# EAGLE schematic COM_R_BOARD (EAGLE 9.6.2)
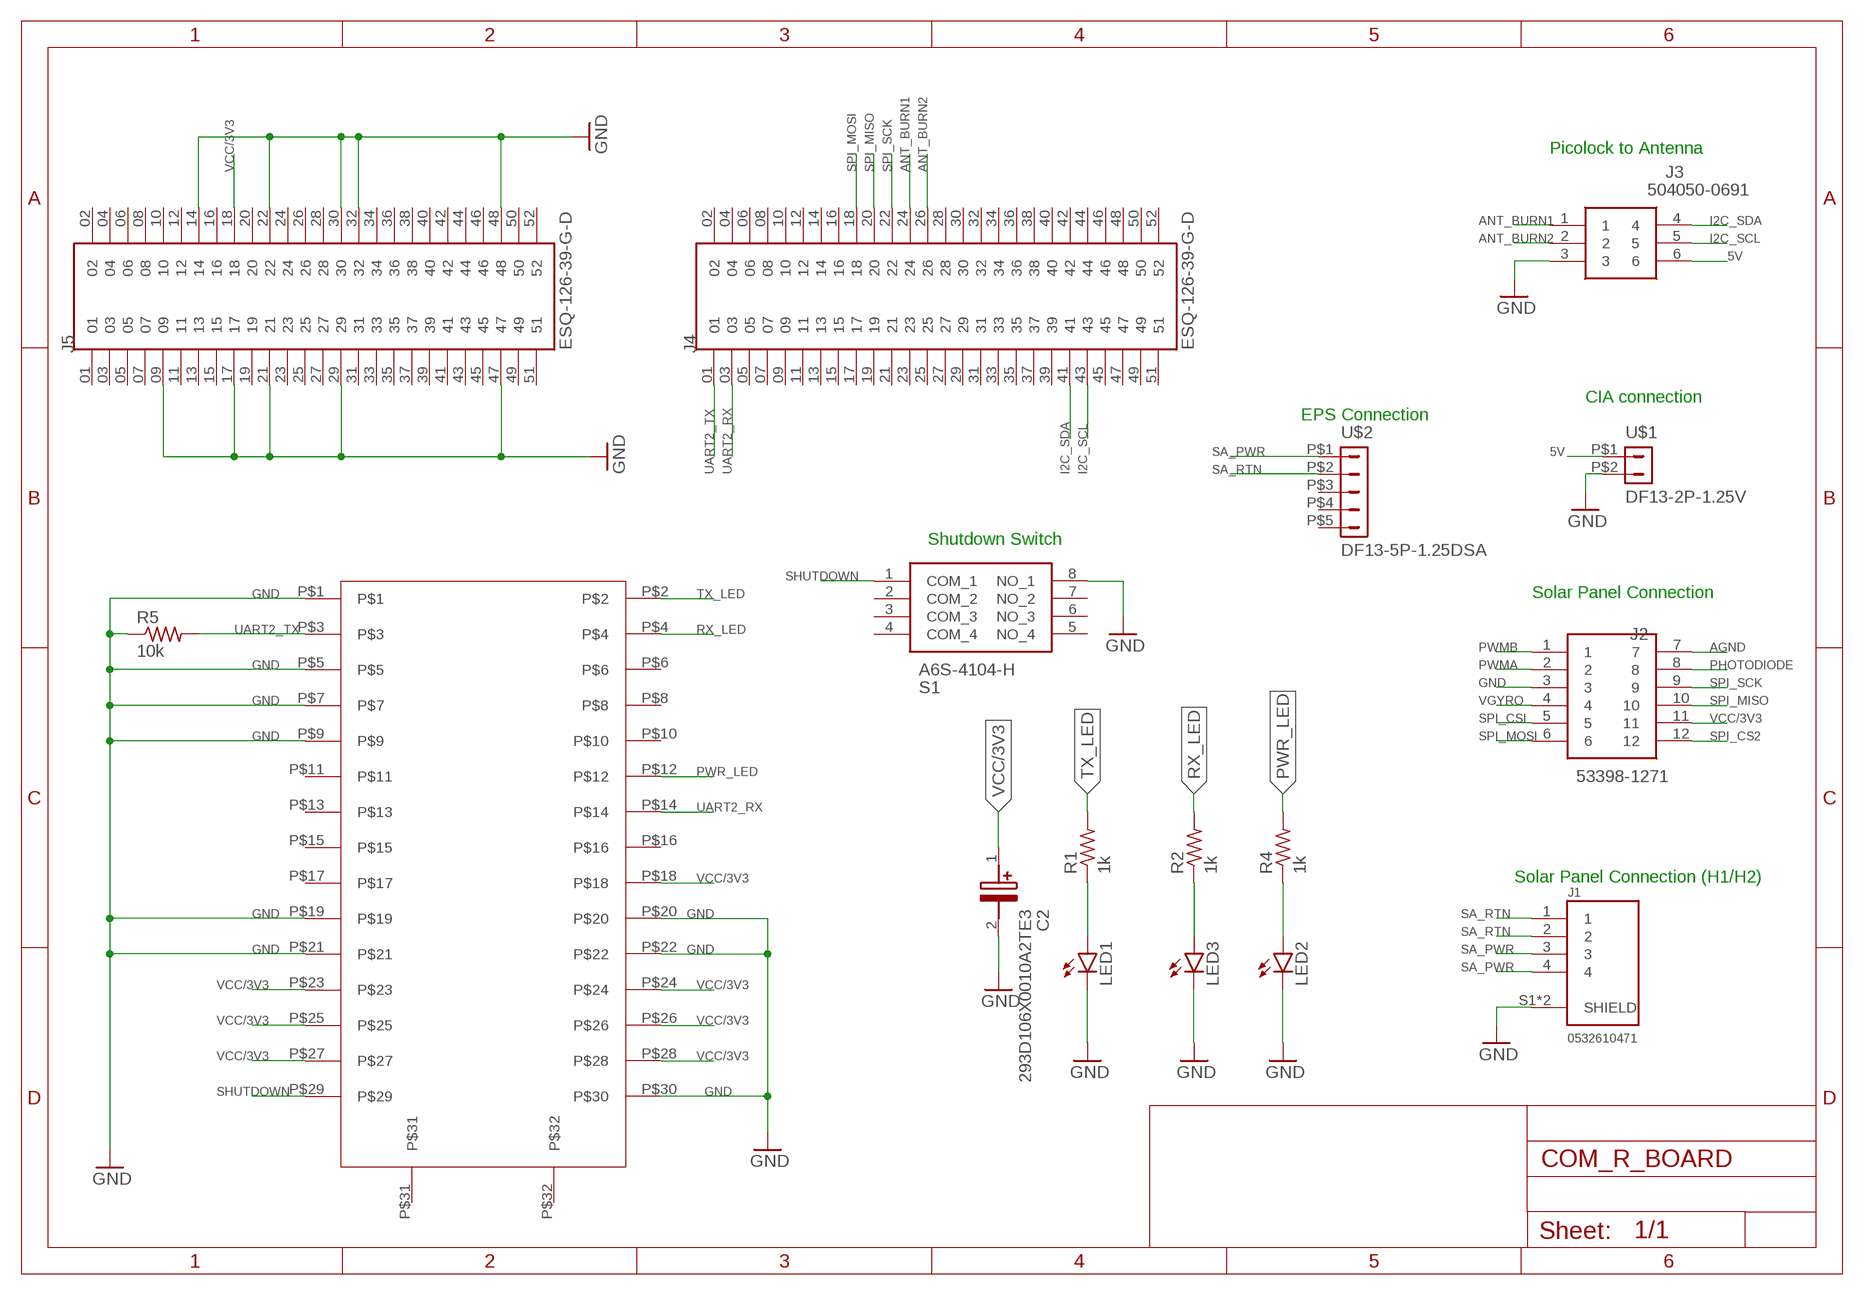
[diagram p0: schematic, sheet 1]

## Parts
C2  293D106X0010A2TE3  [CAPPM3216X180N]
J1  0532610471  [MOLEX_0532610471]
J2  53398-1271  [53398-1271]
J3  504050-0691  [504050-0691_2]
J4  ESQ-126-39-G-D  [SAMTEC_ESQ-126-39-G-D]
J5  ESQ-126-39-G-D  [SAMTEC_ESQ-126-39-G-D]
LED1  LEDCHIP-LED0805  [CHIP-LED0805]
LED2  LEDCHIP-LED0805  [CHIP-LED0805]
LED3  LEDCHIP-LED0805  [CHIP-LED0805]
R1  1k  R-US_M0805  [M0805]
R2  1k  R-US_M0805  [M0805]
R4  1k  R-US_M0805  [M0805]
R5  10k  R-US_WSC01/2  [WSC01/2]
S1  A6S-4104-H  [A6S4104H]
U$1  DF13-2P-1.25V  [DF13C-2P-1.25V]
U$2  DF13-5P-1.25DSA  [DF13-5P-1.25DSA]
U$3  KYOCERA_5046_30PIN  [KYOCERA_5046_30PIN]

## Nets
5V: J3.6 U$1.P$1
AGND: J2.7
ANT_BURN1: J3.1 J4.24
ANT_BURN2: J3.2 J4.26
GND: C2.2(-) J1.S1(SHIELD) J1.S2(SHIELD) J2.3 J3.3 J5.09 J5.14 J5.17 J5.21 J5.22 J5.29 J5.30 J5.32 J5.47 J5.48 LED1.C LED2.C LED3.C R5.1 S1.8(NO_1) U$1.P$2 U$3.P$1 U$3.P$5 U$3.P$7 U$3.P$9 U$3.P$19 U$3.P$20 U$3.P$21 U$3.P$22 U$3.P$30
I2C_SCL: J3.5 J4.43
I2C_SDA: J3.4 J4.41
N$1: LED1.A R1.1
N$4: LED3.A R2.1
N$7: LED2.A R4.1
PHOTODIODE: J2.8
PWMA: J2.2
PWMB: J2.1
PWR_LED: R4.2 U$3.P$12
RX_LED: R2.2 U$3.P$4
SA_PWR: J1.3 J1.4 U$2.P$1
SA_RTN: J1.1 J1.2 U$2.P$2
SHUTDOWN: S1.1(COM_1) U$3.P$29
SPI_CS2: J2.12
SPI_CSI: J2.5
SPI_MISO: J2.10 J4.20
SPI_MOSI: J2.6 J4.18
SPI_SCK: J2.9 J4.22
TX_LED: R1.2 U$3.P$2
UART2_RX: J4.03 U$3.P$14
UART2_TX: J4.01 R5.2 U$3.P$3
VCC/3V3: C2.1(+) J2.11 J5.18 U$3.P$18 U$3.P$23 U$3.P$24 U$3.P$25 U$3.P$26 U$3.P$27 U$3.P$28
VGYRO: J2.4
Unconnected: J4.02 J4.04 J4.05 J4.06 J4.07 J4.08 J4.09 J4.10 J4.11 J4.12 J4.13 J4.14 J4.15 J4.16 J4.17 J4.19 J4.21 J4.23 J4.25 J4.27 J4.28 J4.29 J4.30 J4.31 J4.32 J4.33 J4.34 J4.35 J4.36 J4.37 J4.38 J4.39 J4.40 J4.42 J4.44 J4.45 J4.46 J4.47 J4.48 J4.49 J4.50 J4.51 J4.52 J5.01 J5.02 J5.03 J5.04 J5.05 J5.06 J5.07 J5.08 J5.10 J5.11 J5.12 J5.13 J5.15 J5.16 J5.19 J5.20 J5.23 J5.24 J5.25 J5.26 J5.27 J5.28 J5.31 J5.33 J5.34 J5.35 J5.36 J5.37 J5.38 J5.39 J5.40 J5.41 J5.42 J5.43 J5.44 J5.45 J5.46 J5.49 J5.50 J5.51 J5.52 S1.2(COM_2) S1.3(COM_3) S1.4(COM_4) S1.5(NO_4) S1.6(NO_3) S1.7(NO_2) U$2.P$3 U$2.P$4 U$2.P$5 U$3.P$6 U$3.P$8 U$3.P$10 U$3.P$11 U$3.P$13 U$3.P$15 U$3.P$16 U$3.P$17 U$3.P$31 U$3.P$32

## Notes on the sheet
- Picolock to Antenna
- CIA connection
- EPS Connection
- Shutdown Switch
- Solar Panel Connection
- Solar Panel Connection (H1/H2)

## Library data of the parts
C2 = SamacSys_Parts:293D106X0010A2TE3: Solid Tantalum Surface Mount Chip Capacitors TANTAMOUNT(TM), Molded Case, Standard Industrial Grade Source: Datasheet <https://componentsearchengine.com/Datasheets/1/293D106X0010A2TE3.pdf>; DESCRIPTION: Solid Tantalum Surface Mount Chip Capacitors TANTAMOUNT(TM), Molded Case, Standard Industrial Grade; HEIGHT: 1.8mm; MANUFACTURER_NAME: Vishay; MANUFACTURER_PART_NUMBER: 293D106X0010A2TE3; MOUSER_PART_NUMBER: 74-293D106X0010A2TE3; MOUSER_PRICE-STOCK: https://www.mouser.com/Search/Refine.aspx?Keyword=74-293D106X0010A2TE3
J1 = 0532610471:0532610471: Conn Shrouded Header HDR 4 POS 1.25mm Solder RA SMD PicoBlade™ Embossed T/R; AVAILABILITY: Unavailable; DESCRIPTION: Picoblade Connector, 4 Circuit Single Row, Right Angle Surface Mount SMT PCB; DIGIKEY-PURCHASE-URL: https://snapeda.com/shop?store=DigiKey&id=542805; MF: Molex; MP: 0532610471; PACKAGE: None; PRICE: None
J2 = SamacSys_Parts:53398-1271: 12 way SMT straight header Molex PICOBLADE Series, Series Number 53398, 1.25mm Pitch 12 Way 1 Row Shrouded Straight PCB Header, Surface Mount Source: Datasheet <https://componentsearchengine.com/Datasheets/1/53398-1271.pdf>; DESCRIPTION: 12 way SMT straight header Molex PICOBLADE Series, Series Number 53398, 1.25mm Pitch 12 Way 1 Row Shrouded Straight PCB Header, Surface Mount; HEIGHT: mm; MANUFACTURER_NAME: Molex; MANUFACTURER_PART_NUMBER: 53398-1271; MOUSER_PART_NUMBER: 538-53398-1271; MOUSER_PRICE-STOCK: https://www.mouser.com/Search/Refine.aspx?Keyword=538-53398-1271
J3 = SamacSys_Parts:504050-0691: Pico-Lock SMT Wire-to-Board Header 6 way Molex Pico-Lock Series, Series Number 504050, 1.5mm Pitch 6 Way 1 Row Shrouded Right Angle PCB Header, Surface Mount Source: Datasheet <https://componentsearchengine.com/Datasheets/2/504050-0691.pdfhttp://www.molex.com/pdm_docs/sd/5040500691_sd.pdf>; DESCRIPTION: Pico-Lock SMT Wire-to-Board Header 6 way Molex Pico-Lock Series, Series Number 504050, 1.5mm Pitch 6 Way 1 Row Shrouded Right Angle PCB Header, Surface Mount; HEIGHT: mm; MANUFACTURER_NAME: Molex; MANUFACTURER_PART_NUMBER: 504050-0691; MOUSER_PART_NUMBER: 538-504050-0691; MOUSER_PRICE-STOCK: https://www.mouser.co.uk/ProductDetail/Molex/504050-0691?qs=bvCPb%252BE7ys2K1LQC9e%2FvRg%3D%3D
J4 J5 = ESQ-126-39-G-D:ESQ-126-39-G-D; AVAILABILITY: Unavailable; DESCRIPTION: 52 Position Elevated Socket Connector Through Hole; MF: Samtec; MP: ESQ-126-39-G-D; PACKAGE: None; PRICE: None; TOBY_UK-PURCHASE-URL: https://snapeda.com/shop?store=Toby+UK&id=490181
LED1-LED3 = led:LED: LED OSRAM: - CHIPLED LG R971, LG N971, LY N971, LG Q971, LY Q971, LO R971, LY R971 LH N974, LH R974 LS Q976, LO Q976, LY Q976 LO Q996 - Hyper CHIPLED LW Q18S LB Q993, LB Q99A, LB R99A - SideLED LS A670, LO A670, LY A670, LG A670, LP A670 LB A673, LV A673, LT A673, LW A673 LH A674 LY A675 LS A676, LA A676, LO A676, LY A676, LW A676 LS A679, LY A679, LG A679 - Hyper Micro SIDELED® LS Y876, LA Y876, LO Y876, LY Y876 LT Y87S - SmartLED LW L88C, LW L88S LB L89C, LB L89S, LG L890 LS L89K, LO L89K, LY L89K LS L896, LA L896, LO L896, LY L896 - TOPLED LS T670, LO T670, LY T670, LG T670, LP T670 LSG T670, LSP T670, LSY T670, LOP T670, LYG T670 LG T671, LOG T671, LSG T671 LB T673, LV T673, LT T673, LW T673 LH T674 LS T676, LA T676, LO T676, LY T676, LB T676, LH T676, LSB T676, LW T676 LB T67C, LV T67C, LT T67C, LS T67K, LO T67K, LY T67K, LW E67C LS E67B, LA E67B, LO E67B, LY E67B, LB E67C, LV E67C, LT E67C LW T67C LS T679, LY T679, LG T679 LS T770, LO T770, LY T770, LG T770, LP T770 LB T773, LV T773, LT T773, LW T773 LH T774 LS E675, LA E675, LY E675, LS T675 LS T776, LA T776, LO T776, LY T776, LB T776 LHGB T686 LT T68C, LB T68C - Hyper Mini TOPLED® LB M676 - Mini TOPLED Santana® LG M470 LS M47K, LO M47K, LY M47K Source: http://www.osram.convergy.de LUXEON: - LUMILED® LXK2-PW12-R00, LXK2-PW12-S00, LXK2-PW14-U00, LXK2-PW14-V00 LXK2-PM12-R00, LXK2-PM12-S00, LXK2-PM14-U00 LXK2-PE12-Q00, LXK2-PE12-R00, LXK2-PE12-S00, LXK2-PE14-T00, LXK2-PE14-U00 LXK2-PB12-K00, LXK2-PB12-L00, LXK2-PB12-M00, LXK2-PB14-N00, LXK2-PB14-P00, LXK2-PB14-Q00 LXK2-PR12-L00, LXK2-PR12-M00, LXK2-PR14-Q00, LXK2-PR14-R00 LXK2-PD12-Q00, LXK2-PD12-R00, LXK2-PD12-S00 LXK2-PH12-R00, LXK2-PH12-S00 LXK2-PL12-P00, LXK2-PL12-Q00, LXK2-PL12-R00 Source: www.luxeon.com KINGBRIGHT: KA-3528ASYC Source: www.kingbright.com
R1 R2 R4 R5 = rcl:R-US_: RESISTOR, American symbol; SPICEPREFIX: R
S1 = SamacSys_Parts:A6S-4104-H: 4 Way Surface Mount DIP Switch 4P Source: Datasheet <https://componentsearchengine.com/Datasheets/1/A6S-4104-H.pdf>; DESCRIPTION: 4 Way Surface Mount DIP Switch 4P; HEIGHT: mm; MANUFACTURER_NAME: Omron Electronics; MANUFACTURER_PART_NUMBER: A6S-4104-H; MOUSER_PART_NUMBER: 653-A6S-4104-H; MOUSER_PRICE-STOCK: https://www.mouser.co.uk/ProductDetail/Omron-Electronics/A6S-4104-H?qs=ZP3UR5XsUocSmJ29mwneiw%3D%3D
U$1 = con-hirose-df13:DF13-2P-1.25: DF13-2P 1.25mm Pitch Miniature Crimping Connector.
U$2 = con-hirose-df13:DF13-5P-1.25: DF13-5P 1.25mm Pitch Miniature Crimping Connector.
U$3 = XDLradioConnectorBreakout:KYOCERA_5046_30PIN